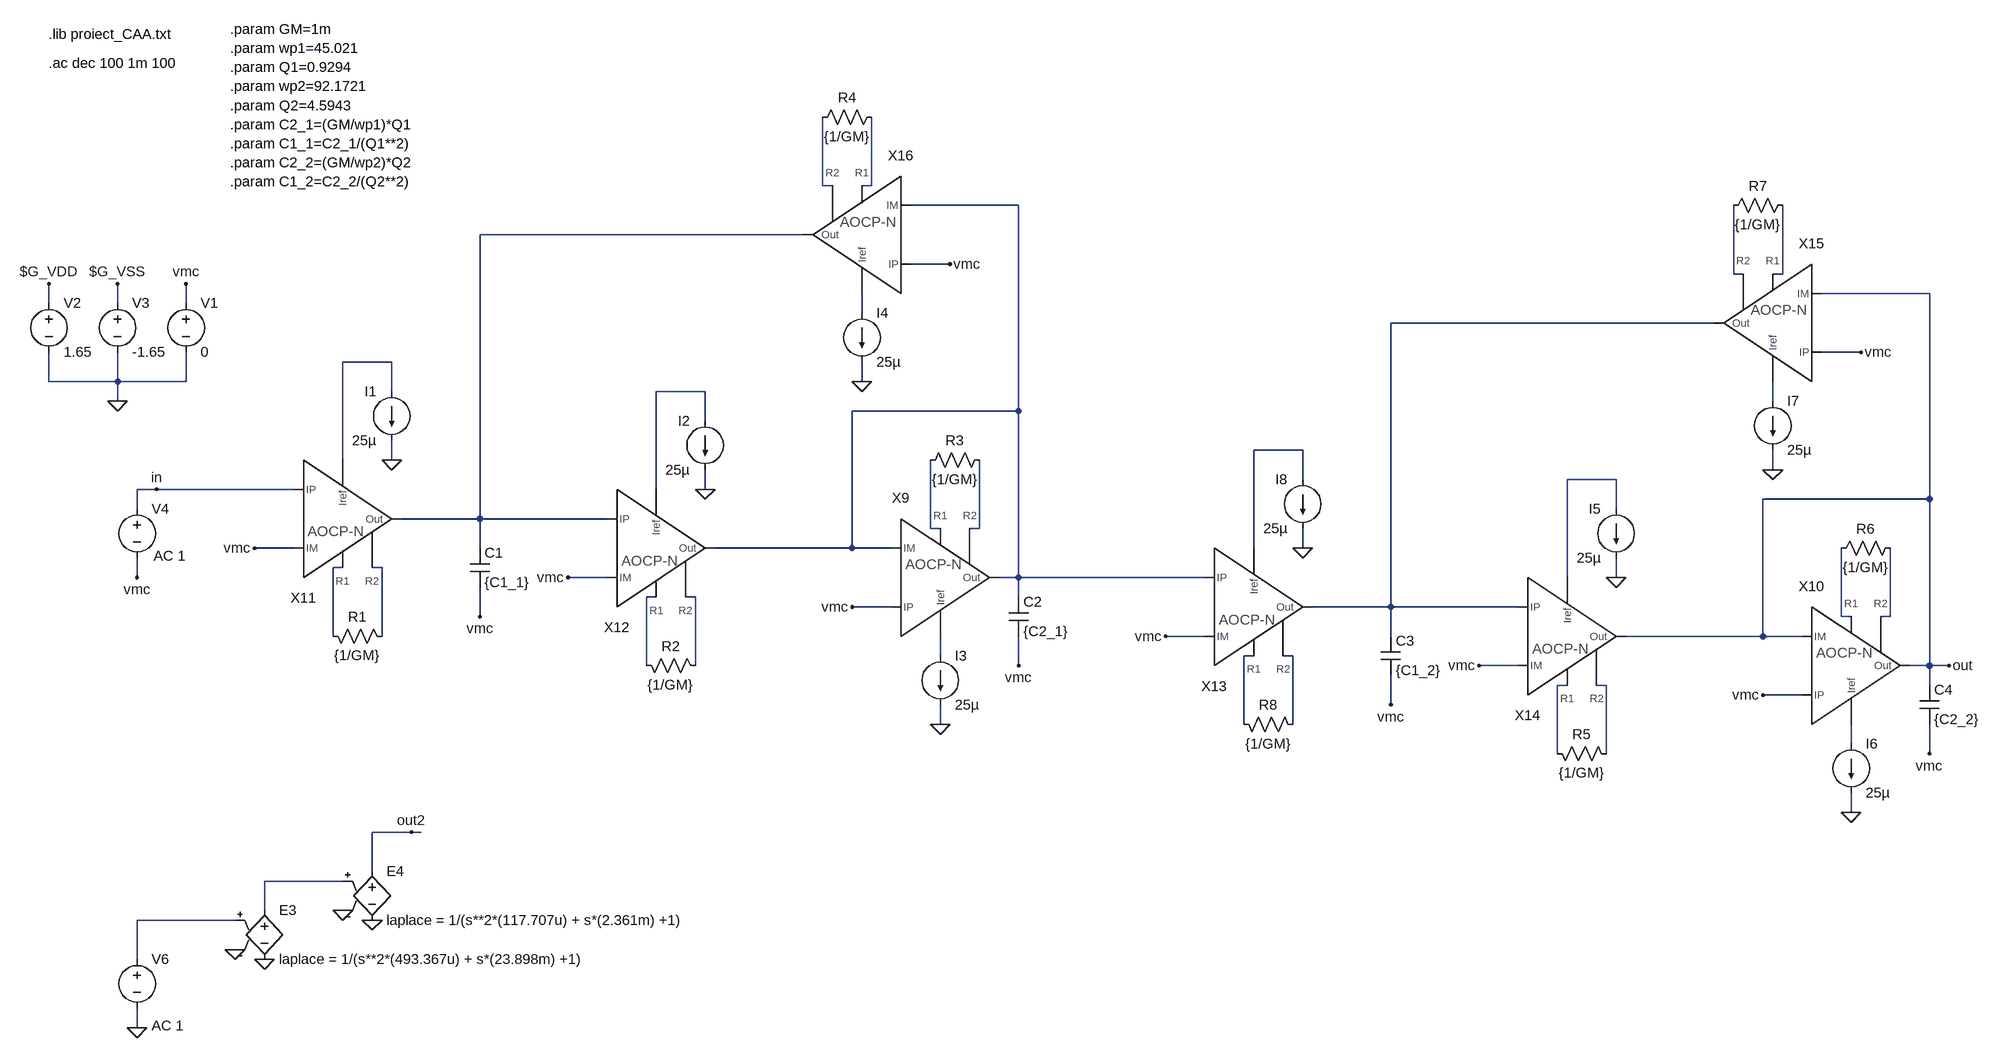
[diagram p0: schematic test_biquad_real_deg.asc]
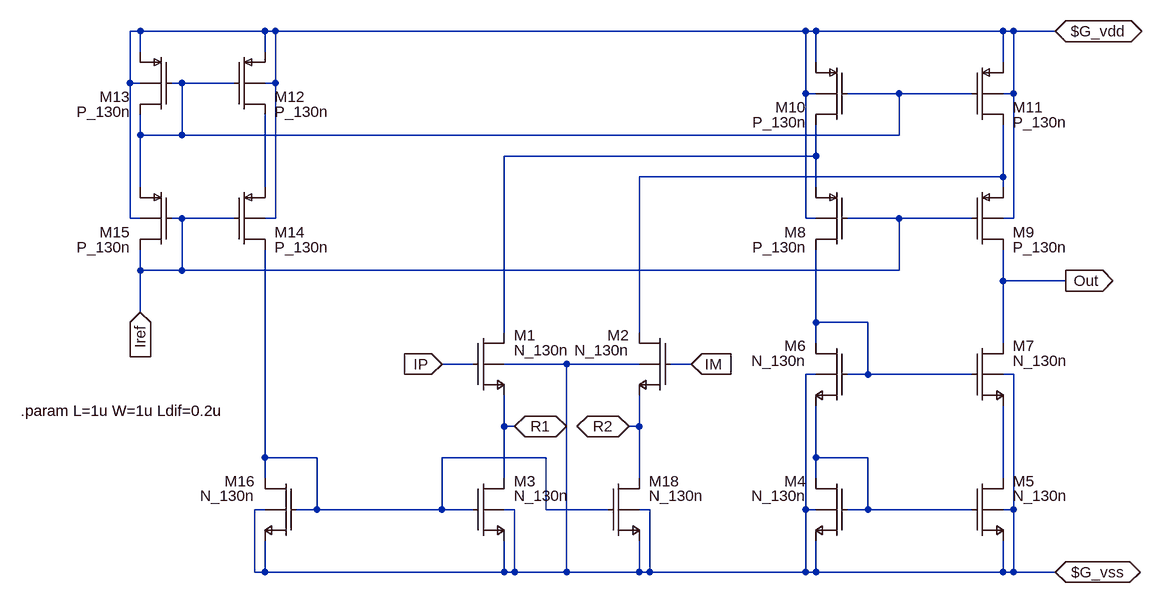
[diagram p1: sub-circuit ao_cp_n_deg.asc]
test_biquad_real_deg.asc, the LTspice schematic file:
Version 4
SHEET 1 3380 1620
WIRE 1424 -112 1424 -224
WIRE 1440 -112 1424 -112
WIRE 1504 -112 1504 -224
WIRE 1504 -112 1488 -112
WIRE 1744 -80 1568 -80
WIRE 1392 -32 864 -32
WIRE 1632 16 1568 16
WIRE 2912 32 2912 -80
WIRE 2928 32 2912 32
WIRE 2992 32 2992 -80
WIRE 2992 32 2976 32
WIRE 3232 64 3056 64
WIRE 160 80 160 48
WIRE 272 80 272 48
WIRE 384 80 384 48
WIRE 1488 96 1488 64
WIRE 2880 112 2352 112
WIRE 3120 160 3056 160
WIRE 720 176 640 176
WIRE 160 208 160 160
WIRE 272 208 272 160
WIRE 272 208 160 208
WIRE 384 208 384 160
WIRE 384 208 272 208
WIRE 1488 208 1488 176
WIRE 720 224 720 176
WIRE 1232 224 1152 224
WIRE 272 240 272 208
WIRE 2976 240 2976 208
WIRE 1744 256 1744 -80
WIRE 1744 256 1472 256
WIRE 1232 272 1232 224
WIRE 2208 320 2128 320
WIRE 640 336 640 176
WIRE 720 336 720 304
WIRE 2976 352 2976 320
WIRE 2208 368 2208 320
WIRE 2720 368 2640 368
WIRE 336 384 304 384
WIRE 560 384 336 384
WIRE 1152 384 1152 224
WIRE 1232 384 1232 352
WIRE 3232 400 3232 64
WIRE 3232 400 2960 400
WIRE 304 416 304 384
WIRE 2720 416 2720 368
WIRE 864 432 864 -32
WIRE 864 432 736 432
WIRE 1072 432 864 432
WIRE 1600 448 1600 336
WIRE 1616 448 1600 448
WIRE 1680 448 1680 336
WIRE 1680 448 1664 448
WIRE 560 480 496 480
WIRE 864 480 864 432
WIRE 1472 480 1472 256
WIRE 1472 480 1248 480
WIRE 1536 480 1472 480
WIRE 2128 480 2128 320
WIRE 2208 480 2208 448
WIRE 640 512 624 512
WIRE 704 512 688 512
WIRE 304 528 304 496
WIRE 1072 528 1008 528
WIRE 1744 528 1744 256
WIRE 1744 528 1712 528
WIRE 2048 528 1744 528
WIRE 2640 528 2640 368
WIRE 2720 528 2720 496
WIRE 1152 560 1136 560
WIRE 1216 560 1200 560
WIRE 1744 560 1744 528
WIRE 1536 576 1472 576
WIRE 2352 576 2352 112
WIRE 2352 576 2224 576
WIRE 2560 576 2352 576
WIRE 864 592 864 544
WIRE 3088 592 3088 480
WIRE 3104 592 3088 592
WIRE 3168 592 3168 480
WIRE 3168 592 3152 592
WIRE 624 624 624 512
WIRE 704 624 704 512
WIRE 2048 624 1984 624
WIRE 2352 624 2352 576
WIRE 2960 624 2960 400
WIRE 2960 624 2736 624
WIRE 3024 624 2960 624
WIRE 1616 656 1616 624
WIRE 2128 656 2112 656
WIRE 2192 656 2176 656
WIRE 1136 672 1136 560
WIRE 1216 672 1216 560
WIRE 1744 672 1744 624
WIRE 2560 672 2496 672
WIRE 3232 672 3232 400
WIRE 3232 672 3200 672
WIRE 3264 672 3232 672
WIRE 2640 704 2624 704
WIRE 2704 704 2688 704
WIRE 3232 704 3232 672
WIRE 3024 720 2960 720
WIRE 2352 736 2352 688
WIRE 1616 768 1616 736
WIRE 2112 768 2112 656
WIRE 2192 768 2192 656
WIRE 3104 800 3104 768
WIRE 2624 816 2624 704
WIRE 2704 816 2704 704
WIRE 3232 816 3232 768
WIRE 3104 912 3104 880
WIRE 752 944 688 944
WIRE 768 944 752 944
WIRE 688 1008 688 944
WIRE 640 1024 512 1024
WIRE 512 1072 512 1024
WIRE 464 1088 304 1088
WIRE 304 1152 304 1088
WIRE 304 1264 304 1232
FLAG 272 240 0
FLAG 160 48 $G_VDD
FLAG 272 48 $G_VSS
FLAG 384 48 vmc
FLAG 304 528 vmc
FLAG 336 384 in
FLAG 1008 528 vmc
FLAG 1472 576 vmc
FLAG 1632 16 vmc
FLAG 1232 384 0
FLAG 1616 768 0
FLAG 1488 208 0
FLAG 864 592 vmc
FLAG 1744 672 vmc
FLAG 496 480 vmc
FLAG 720 336 0
FLAG 464 1136 0
FLAG 512 1152 0
FLAG 640 1072 0
FLAG 688 1088 0
FLAG 304 1264 0
FLAG 752 944 out2
FLAG 3264 672 out
FLAG 2496 672 vmc
FLAG 2960 720 vmc
FLAG 3120 160 vmc
FLAG 2720 528 0
FLAG 3104 912 0
FLAG 2976 352 0
FLAG 2352 736 vmc
FLAG 3232 816 vmc
FLAG 1984 624 vmc
FLAG 2208 480 0
SYMBOL voltage 160 64 R0
WINDOW 123 0 0 Left 2
WINDOW 39 0 0 Left 2
SYMATTR InstName V2
SYMATTR Value 1.65
SYMBOL voltage 272 64 R0
WINDOW 123 0 0 Left 2
WINDOW 39 0 0 Left 2
SYMATTR InstName V3
SYMATTR Value -1.65
SYMBOL voltage 384 64 R0
WINDOW 123 0 0 Left 2
WINDOW 39 0 0 Left 2
SYMATTR InstName V1
SYMATTR Value 0
SYMBOL voltage 304 400 R0
WINDOW 3 29 109 Left 2
WINDOW 123 27 93 Left 2
WINDOW 39 0 0 Left 2
SYMATTR Value ""
SYMATTR Value2 AC 1
SYMATTR InstName V4
SYMBOL cap 848 480 R0
SYMATTR InstName C1
SYMATTR Value {C1_1}
SYMBOL cap 1728 560 R0
SYMATTR InstName C2
SYMATTR Value {C2_1}
SYMBOL current 1232 272 M0
WINDOW 123 0 0 Left 0
WINDOW 39 0 0 Left 0
SYMATTR InstName I2
SYMATTR Value 25µ
SYMBOL current 1616 656 R0
WINDOW 123 0 0 Left 0
WINDOW 39 0 0 Left 0
SYMATTR InstName I3
SYMATTR Value 25µ
SYMBOL current 1488 96 R0
WINDOW 123 0 0 Left 0
WINDOW 39 0 0 Left 0
SYMATTR InstName I4
SYMATTR Value 25µ
SYMBOL res 1232 688 M270
WINDOW 0 32 56 VTop 2
WINDOW 3 0 56 VBottom 2
SYMATTR InstName R2
SYMATTR Value {1/GM}
SYMBOL res 1696 320 R90
WINDOW 0 0 56 VBottom 2
WINDOW 3 32 56 VTop 2
SYMATTR InstName R3
SYMATTR Value {1/GM}
SYMBOL res 1520 -240 R90
WINDOW 0 0 56 VBottom 2
WINDOW 3 32 56 VTop 2
SYMATTR InstName R4
SYMATTR Value {1/GM}
SYMBOL current 720 224 M0
WINDOW 123 0 0 Left 0
WINDOW 39 0 0 Left 0
SYMATTR InstName I1
SYMATTR Value 25µ
SYMBOL res 720 640 M270
WINDOW 0 32 56 VTop 2
WINDOW 3 0 56 VBottom 2
SYMATTR InstName R1
SYMATTR Value {1/GM}
SYMBOL e 512 1056 R0
SYMATTR InstName E3
SYMATTR Value laplace = 1/(s**2*(493.367u) + s*(23.898m) +1)
SYMBOL e 688 992 R0
SYMATTR InstName E4
SYMATTR Value laplace = 1/(s**2*(117.707u) + s*(2.361m) +1)
SYMBOL voltage 304 1136 R0
WINDOW 123 24 124 Left 2
WINDOW 39 0 0 Left 0
WINDOW 3 24 44 Left 2
SYMATTR Value2 AC 1
SYMATTR Value ""
SYMATTR InstName V6
SYMBOL cap 2336 624 R0
SYMATTR InstName C3
SYMATTR Value {C1_2}
SYMBOL cap 3216 704 R0
SYMATTR InstName C4
SYMATTR Value {C2_2}
SYMBOL current 2720 416 M0
WINDOW 123 0 0 Left 0
WINDOW 39 0 0 Left 0
SYMATTR InstName I5
SYMATTR Value 25µ
SYMBOL current 3104 800 R0
WINDOW 123 0 0 Left 0
WINDOW 39 0 0 Left 0
SYMATTR InstName I6
SYMATTR Value 25µ
SYMBOL current 2976 240 R0
WINDOW 123 0 0 Left 0
WINDOW 39 0 0 Left 0
SYMATTR InstName I7
SYMATTR Value 25µ
SYMBOL res 2720 832 M270
WINDOW 0 32 56 VTop 2
WINDOW 3 0 56 VBottom 2
SYMATTR InstName R5
SYMATTR Value {1/GM}
SYMBOL res 3184 464 R90
WINDOW 0 0 56 VBottom 2
WINDOW 3 32 56 VTop 2
SYMATTR InstName R6
SYMATTR Value {1/GM}
SYMBOL res 3008 -96 R90
WINDOW 0 0 56 VBottom 2
WINDOW 3 32 56 VTop 2
SYMATTR InstName R7
SYMATTR Value {1/GM}
SYMBOL current 2208 368 M0
WINDOW 123 0 0 Left 0
WINDOW 39 0 0 Left 0
SYMATTR InstName I8
SYMATTR Value 25µ
SYMBOL res 2208 784 M270
WINDOW 0 32 56 VTop 2
WINDOW 3 0 56 VBottom 2
SYMATTR InstName R8
SYMATTR Value {1/GM}
SYMBOL ao_cp_n_deg 1584 528 R0
SYMATTR InstName X9
SYMBOL ao_cp_n_deg 3072 672 R0
SYMATTR InstName X10
SYMBOL ao_cp_n_deg 608 432 M180
SYMATTR InstName X11
SYMBOL ao_cp_n_deg 1120 480 M180
SYMATTR InstName X12
SYMBOL ao_cp_n_deg 2096 576 M180
SYMATTR InstName X13
SYMBOL ao_cp_n_deg 2608 624 M180
SYMATTR InstName X14
SYMBOL ao_cp_n_deg 3008 112 M0
SYMATTR InstName X15
SYMBOL ao_cp_n_deg 1520 -32 M0
SYMATTR InstName X16
TEXT 160 -360 Left 2 !.lib proiect_CAA.txt
TEXT 160 -312 Left 2 !.ac dec 100 1m 100
TEXT 456 -368 Left 2 !.param GM=1m\n.param wp1=45.021\n.param Q1=0.9294\n.param wp2=92.1721\n.param Q2=4.5943\n.param C2_1=(GM/wp1)*Q1\n.param C1_1=C2_1/(Q1**2)\n.param C2_2=(GM/wp2)*Q2\n.param C1_2=C2_2/(Q2**2)

ao_cp_n_deg.asc, the sub-circuit schematic file:
Version 4
SHEET 1 2836 1240
WIRE 464 -448 448 -448
WIRE 656 -448 464 -448
WIRE 672 -448 656 -448
WIRE 1488 -448 672 -448
WIRE 1504 -448 1488 -448
WIRE 1792 -448 1504 -448
WIRE 1808 -448 1792 -448
WIRE 1872 -448 1808 -448
WIRE 464 -416 464 -448
WIRE 656 -416 656 -448
WIRE 1504 -400 1504 -448
WIRE 1792 -400 1792 -448
WIRE 448 -368 448 -448
WIRE 464 -368 448 -368
WIRE 528 -368 512 -368
WIRE 608 -368 528 -368
WIRE 672 -368 672 -448
WIRE 672 -368 656 -368
WIRE 1488 -352 1488 -448
WIRE 1504 -352 1488 -352
WIRE 1632 -352 1552 -352
WIRE 1744 -352 1632 -352
WIRE 1808 -352 1808 -448
WIRE 1808 -352 1792 -352
WIRE 464 -288 464 -320
WIRE 528 -288 528 -368
WIRE 528 -288 464 -288
WIRE 1632 -288 1632 -352
WIRE 1632 -288 528 -288
WIRE 1504 -256 1504 -304
WIRE 1504 -256 1024 -256
WIRE 1792 -224 1792 -304
WIRE 1792 -224 1232 -224
WIRE 464 -208 464 -288
WIRE 656 -208 656 -320
WIRE 1504 -208 1504 -256
WIRE 1792 -208 1792 -224
WIRE 448 -160 448 -368
WIRE 464 -160 448 -160
WIRE 528 -160 512 -160
WIRE 608 -160 528 -160
WIRE 672 -160 672 -368
WIRE 672 -160 656 -160
WIRE 1488 -160 1488 -352
WIRE 1504 -160 1488 -160
WIRE 1632 -160 1552 -160
WIRE 1744 -160 1632 -160
WIRE 1808 -160 1808 -352
WIRE 1808 -160 1792 -160
WIRE 464 -80 464 -112
WIRE 528 -80 528 -160
WIRE 528 -80 464 -80
WIRE 1632 -80 1632 -160
WIRE 1632 -80 528 -80
WIRE 1792 -64 1792 -112
WIRE 1888 -64 1792 -64
WIRE 464 -16 464 -80
WIRE 1504 0 1504 -112
WIRE 1584 0 1504 0
WIRE 1024 16 1024 -256
WIRE 1232 16 1232 -224
WIRE 1504 32 1504 0
WIRE 1792 32 1792 -64
WIRE 976 64 928 64
WIRE 1120 64 1024 64
WIRE 1232 64 1120 64
WIRE 1312 64 1280 64
WIRE 1504 80 1488 80
WIRE 1584 80 1584 0
WIRE 1584 80 1552 80
WIRE 1744 80 1584 80
WIRE 1808 80 1792 80
WIRE 1024 160 1024 112
WIRE 1040 160 1024 160
WIRE 1232 160 1232 112
WIRE 1232 160 1216 160
WIRE 656 208 656 -112
WIRE 736 208 656 208
WIRE 1088 208 928 208
WIRE 1504 208 1504 128
WIRE 1584 208 1504 208
WIRE 656 240 656 208
WIRE 1024 240 1024 160
WIRE 1232 240 1232 160
WIRE 1504 240 1504 208
WIRE 1792 240 1792 128
WIRE 656 288 640 288
WIRE 736 288 736 208
WIRE 736 288 704 288
WIRE 928 288 928 208
WIRE 928 288 736 288
WIRE 976 288 928 288
WIRE 1040 288 1024 288
WIRE 1088 288 1088 208
WIRE 1184 288 1088 288
WIRE 1248 288 1232 288
WIRE 1488 288 1488 80
WIRE 1504 288 1488 288
WIRE 1584 288 1584 208
WIRE 1584 288 1552 288
WIRE 1744 288 1584 288
WIRE 1808 288 1808 80
WIRE 1808 288 1792 288
WIRE 640 384 640 288
WIRE 656 384 656 336
WIRE 656 384 640 384
WIRE 1024 384 1024 336
WIRE 1024 384 656 384
WIRE 1040 384 1040 288
WIRE 1040 384 1024 384
WIRE 1120 384 1120 64
WIRE 1120 384 1040 384
WIRE 1232 384 1232 336
WIRE 1232 384 1120 384
WIRE 1248 384 1248 288
WIRE 1248 384 1232 384
WIRE 1488 384 1488 288
WIRE 1488 384 1248 384
WIRE 1504 384 1504 336
WIRE 1504 384 1488 384
WIRE 1792 384 1792 336
WIRE 1792 384 1504 384
WIRE 1808 384 1808 288
WIRE 1808 384 1792 384
WIRE 1872 384 1808 384
FLAG 928 64 IP
IOPIN 928 64 In
FLAG 1888 -64 Out
IOPIN 1888 -64 Out
FLAG 1312 64 IM
IOPIN 1312 64 In
FLAG 1872 -448 $G_vdd
IOPIN 1872 -448 BiDir
FLAG 1872 384 $G_vss
IOPIN 1872 384 BiDir
FLAG 464 -16 Iref
IOPIN 464 -16 In
FLAG 1040 160 R1
IOPIN 1040 160 BiDir
FLAG 1216 160 R2
IOPIN 1216 160 BiDir
SYMBOL nmosb 976 16 R0
SYMATTR InstName M1
SYMATTR Value N_130n
SYMATTR Value2 l={L} w=134u ad={Ldif*134u} as={Ldif*134u} pd={(Ldif+134u)*2} ps={(Ldif+134u)*2} m=1
SYMBOL pmosb 1552 -208 M0
SYMATTR InstName M8
SYMATTR Value P_130n
SYMATTR Value2 l={L} w=41u ad={Ldif*41u} as={Ldif*41u} pd={(Ldif+41u)*2} ps={(Ldif+41u)*2} m=1
SYMBOL nmosb 1280 16 M0
SYMATTR InstName M2
SYMATTR Value N_130n
SYMATTR Value2 l={L} w=134u ad={Ldif*134u} as={Ldif*134u} pd={(Ldif+134u)*2} ps={(Ldif+134u)*2} m=1
SYMBOL nmosb 976 240 R0
SYMATTR InstName M3
SYMATTR Value N_130n
SYMATTR Value2 l=3u w=19u ad={Ldif*19u} as={Ldif*19u} pd={(Ldif+19u)*2} ps={(Ldif+19u)*2} m=2.5
SYMBOL nmosb 1552 240 M0
SYMATTR InstName M4
SYMATTR Value N_130n
SYMATTR Value2 l={L} w=14u ad={Ldif*14u} as={Ldif*14u} pd={(Ldif+14u)*2} ps={(Ldif+14u)*2} m=1
SYMBOL nmosb 1744 240 R0
SYMATTR InstName M5
SYMATTR Value N_130n
SYMATTR Value2 l={L} w=14u ad={Ldif*14u} as={Ldif*14u} pd={(Ldif+14u)*2} ps={(Ldif+14u)*2} m=1
SYMBOL nmosb 1552 32 M0
SYMATTR InstName M6
SYMATTR Value N_130n
SYMATTR Value2 l={L} w=14u ad={Ldif*14u} as={Ldif*14u} pd={(Ldif+14u)*2} ps={(Ldif+14u)*2} m=1
SYMBOL nmosb 1744 32 R0
SYMATTR InstName M7
SYMATTR Value N_130n
SYMATTR Value2 l={L} w=14u ad={Ldif*14u} as={Ldif*14u} pd={(Ldif+14u)*2} ps={(Ldif+14u)*2} m=1
SYMBOL pmosb 1744 -208 R0
SYMATTR InstName M9
SYMATTR Value P_130n
SYMATTR Value2 l={L} w=41u ad={Ldif*41u} as={Ldif*41u} pd={(Ldif+41u)*2} ps={(Ldif+41u)*2} m=1
SYMBOL pmosb 1552 -400 M0
SYMATTR InstName M10
SYMATTR Value P_130n
SYMATTR Value2 l={L} w=68u ad={Ldif*68u} as={Ldif*68u} pd={(Ldif+68u)*2} ps={(Ldif+68u)*2} m=1
SYMBOL pmosb 1744 -400 R0
SYMATTR InstName M11
SYMATTR Value P_130n
SYMATTR Value2 l={L} w=68u ad={Ldif*68u} as={Ldif*68u} pd={(Ldif+68u)*2} ps={(Ldif+68u)*2} m=1
SYMBOL pmosb 608 -416 R0
SYMATTR InstName M12
SYMATTR Value P_130n
SYMATTR Value2 l=1u w=13u ad={Ldif*13u} as={Ldif*13u} pd={(Ldif+13u)*2} ps={(Ldif+13u)*2} m=1
SYMBOL pmosb 512 -416 M0
SYMATTR InstName M13
SYMATTR Value P_130n
SYMATTR Value2 l=1u w=13u ad={Ldif*13u} as={Ldif*13u} pd={(Ldif+13u)*2} ps={(Ldif+13u)*2} m=1
SYMBOL pmosb 608 -208 R0
SYMATTR InstName M14
SYMATTR Value P_130n
SYMATTR Value2 l=1u w=10u ad={Ldif*10u} as={Ldif*10u} pd={(Ldif+10u)*2} ps={(Ldif+10u)*2} m=1
SYMBOL pmosb 512 -208 M0
SYMATTR InstName M15
SYMATTR Value P_130n
SYMATTR Value2 l=1u w=10u ad={Ldif*10u} as={Ldif*10u} pd={(Ldif+10u)*2} ps={(Ldif+10u)*2} m=1
SYMBOL nmosb 704 240 M0
SYMATTR InstName M16
SYMATTR Value N_130n
SYMATTR Value2 l=3u w=19u ad={Ldif*19u} as={Ldif*19u} pd={(Ldif+19u)*2} ps={(Ldif+19u)*2} m=1
SYMBOL nmosb 1184 240 R0
SYMATTR InstName M18
SYMATTR Value N_130n
SYMATTR Value2 l=3u w=19u ad={Ldif*19u} as={Ldif*19u} pd={(Ldif+19u)*2} ps={(Ldif+19u)*2} m=2.5
TEXT 280 136 Left 2 !.param L=1u W=1u Ldif=0.2u

The netlist it stands for:
* test_biquad_real_deg.asc
V2 $G_VDD 0 1.65
V3 $G_VSS 0 -1.65
V1 vmc 0 0
V4 in vmc AC 1
C1 N004 vmc {C1_1}
C2 N003 vmc {C2_1}
I2 N010 0 25µ
I3 N022 0 25µ
I4 N007 0 25µ
R2 N019 N018 {1/GM}
R3 N015 N014 {1/GM}
R4 N002 N001 {1/GM}
I1 N009 0 25µ
R1 N017 N016 {1/GM}
E3 N028 0 N029 0 laplace = 1/(s**2*(493.367u) + s*(23.898m) +1)
E4 out2 0 N028 0 laplace = 1/(s**2*(117.707u) + s*(2.361m) +1)
V6 N029 0 AC 1
C3 N008 vmc {C1_2}
C4 out vmc {C2_2}
I5 N013 0 25µ
I6 N027 0 25µ
I7 N011 0 25µ
R5 N026 N025 {1/GM}
R6 N021 N020 {1/GM}
R7 N006 N005 {1/GM}
I8 N012 0 25µ
R8 N024 N023 {1/GM}
XX9 N003 vmc N003 N022 N014 N015 ao_cp_n_deg
XX10 out vmc out N027 N020 N021 ao_cp_n_deg
XX11 vmc in N004 N009 N016 N017 ao_cp_n_deg
XX12 vmc N004 N003 N010 N018 N019 ao_cp_n_deg
XX13 vmc N003 N008 N012 N023 N024 ao_cp_n_deg
XX14 vmc N008 out N013 N025 N026 ao_cp_n_deg
XX15 out vmc N008 N011 N006 N005 ao_cp_n_deg
XX16 N003 vmc N004 N007 N002 N001 ao_cp_n_deg

* block symbol definitions
.subckt ao_cp_n_deg IM IP Out Iref R1 R2
M1 N002 IP R1 $G_vss N_130n l={L} w=134u ad={Ldif*134u} as={Ldif*134u} pd={(Ldif+134u)*2} ps={(Ldif+134u)*2} m=1
M8 N005 Iref N002 $G_vdd P_130n l={L} w=41u ad={Ldif*41u} as={Ldif*41u} pd={(Ldif+41u)*2} ps={(Ldif+41u)*2} m=1
M2 N003 IM R2 $G_vss N_130n l={L} w=134u ad={Ldif*134u} as={Ldif*134u} pd={(Ldif+134u)*2} ps={(Ldif+134u)*2} m=1
M3 R1 N006 $G_vss $G_vss N_130n l=3u w=19u ad={Ldif*19u} as={Ldif*19u} pd={(Ldif+19u)*2} ps={(Ldif+19u)*2} m=2.5
M4 N007 N007 $G_vss $G_vss N_130n l={L} w=14u ad={Ldif*14u} as={Ldif*14u} pd={(Ldif+14u)*2} ps={(Ldif+14u)*2} m=1
M5 N008 N007 $G_vss $G_vss N_130n l={L} w=14u ad={Ldif*14u} as={Ldif*14u} pd={(Ldif+14u)*2} ps={(Ldif+14u)*2} m=1
M6 N005 N005 N007 $G_vss N_130n l={L} w=14u ad={Ldif*14u} as={Ldif*14u} pd={(Ldif+14u)*2} ps={(Ldif+14u)*2} m=1
M7 Out N005 N008 $G_vss N_130n l={L} w=14u ad={Ldif*14u} as={Ldif*14u} pd={(Ldif+14u)*2} ps={(Ldif+14u)*2} m=1
M9 Out Iref N003 $G_vdd P_130n l={L} w=41u ad={Ldif*41u} as={Ldif*41u} pd={(Ldif+41u)*2} ps={(Ldif+41u)*2} m=1
M10 N002 N001 $G_vdd $G_vdd P_130n l={L} w=68u ad={Ldif*68u} as={Ldif*68u} pd={(Ldif+68u)*2} ps={(Ldif+68u)*2} m=1
M11 N003 N001 $G_vdd $G_vdd P_130n l={L} w=68u ad={Ldif*68u} as={Ldif*68u} pd={(Ldif+68u)*2} ps={(Ldif+68u)*2} m=1
M12 N004 N001 $G_vdd $G_vdd P_130n l=1u w=13u ad={Ldif*13u} as={Ldif*13u} pd={(Ldif+13u)*2} ps={(Ldif+13u)*2} m=1
M13 N001 N001 $G_vdd $G_vdd P_130n l=1u w=13u ad={Ldif*13u} as={Ldif*13u} pd={(Ldif+13u)*2} ps={(Ldif+13u)*2} m=1
M14 N006 Iref N004 $G_vdd P_130n l=1u w=10u ad={Ldif*10u} as={Ldif*10u} pd={(Ldif+10u)*2} ps={(Ldif+10u)*2} m=1
M15 Iref Iref N001 $G_vdd P_130n l=1u w=10u ad={Ldif*10u} as={Ldif*10u} pd={(Ldif+10u)*2} ps={(Ldif+10u)*2} m=1
M16 N006 N006 $G_vss $G_vss N_130n l=3u w=19u ad={Ldif*19u} as={Ldif*19u} pd={(Ldif+19u)*2} ps={(Ldif+19u)*2} m=1
M18 R2 N006 $G_vss $G_vss N_130n l=3u w=19u ad={Ldif*19u} as={Ldif*19u} pd={(Ldif+19u)*2} ps={(Ldif+19u)*2} m=2.5
.param L=1u W=1u Ldif=0.2u
.ends ao_cp_n_deg

.model NMOS NMOS
.model PMOS PMOS
.lib standard.mos
.lib proiect_CAA.txt
.ac dec 100 1m 100
.param GM=1m
.param wp1=45.021
.param Q1=0.9294
.param wp2=92.1721
.param Q2=4.5943
.param C2_1=(GM/wp1)*Q1
.param C1_1=C2_1/(Q1**2)
.param C2_2=(GM/wp2)*Q2
.param C1_2=C2_2/(Q2**2)
.backanno
.end